# Altium schematic sheet Ext_connectors.SchDoc: SPEC-A7
size 420 x 297 mm; Author: G.Kasprowicz; CompanyName: WUT ISE; DrawnBy: G.Kasprowicz; Organization: WUT ISE; Address1: PW ISE; Address2: Nowowiejska 15/19 00-665 Warsaw; Address3: gkasprow@gmail.com; Revision: 2; SheetNumber: 14; SheetTotal: 18; ModifiedBy: -; CheckedDate: -; Title2: Mezzanine connectors; DivGrp: WUT ISE; Designer: G.Kasprowicz; ModifiedDate: -; ProjectName: Sensor Box
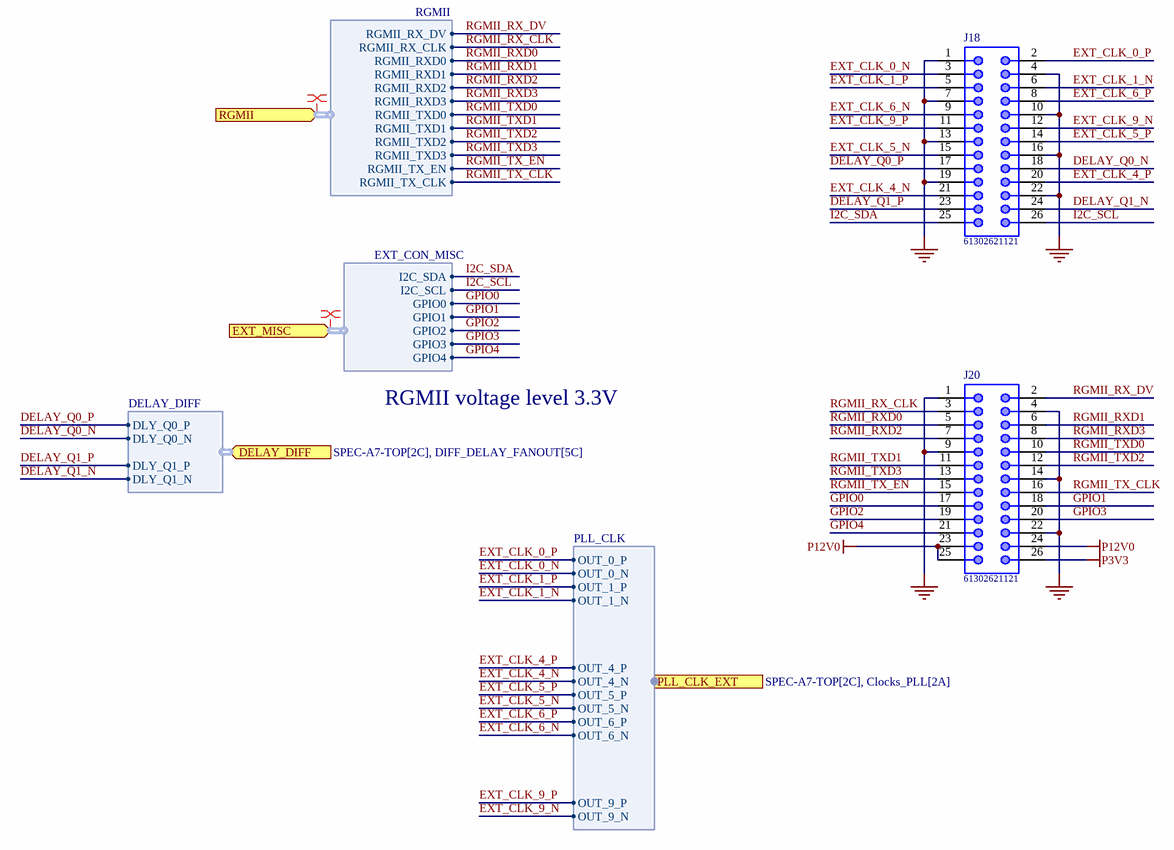
[diagram p0: Ext_connectors.SchDoc]

## Parts
J18  61302621121  [61302621121]
J20  61302621121  [61302621121]

## Ports
DELAY_DIFF (in, harness DELAY_DIFF, see SPEC-A7-TOP[2C], DIFF_DELAY_FANOUT[5C]), EXT_MISC (in, harness EXT_CON_MISC, see SPEC-A7-TOP[2C], FPGA_34[4B]), PLL_CLK_EXT (harness PLL_CLK, see SPEC-A7-TOP[2C], Clocks_PLL[2A]), RGMII (in, harness RGMII, see SPEC-A7-TOP[2C], FPGA_34[4D])

## Harnesses
RGMII: RGMII_RX_DV, RGMII_RX_CLK, RGMII_RXD0, RGMII_RXD1, RGMII_RXD2, RGMII_RXD3, RGMII_TXD0, RGMII_TXD1, RGMII_TXD2, RGMII_TXD3, RGMII_TX_EN, RGMII_TX_CLK
EXT_CON_MISC: I2C_SDA, I2C_SCL, GPIO0, GPIO1, GPIO2, GPIO3, GPIO4
PLL_CLK: OUT_0_P, OUT_0_N, OUT_1_P, OUT_1_N, OUT_4_P, OUT_4_N, OUT_5_P, OUT_5_N, OUT_6_P, OUT_6_N, OUT_9_P, OUT_9_N
DELAY_DIFF: DLY_Q0_P, DLY_Q0_N, DLY_Q1_P, DLY_Q1_N

## Nets
GND: J18.1 J18.4 J18.7 J18.10 J18.13 J18.16 J18.19 J18.22 J20.1 J20.4 J20.9 J20.14 J20.22
P3V3: J20.26
P12V0: J20.23 J20.24 J20.25
DELAY_Q0_N: J18.18 ; port DELAY_DIFF.DLY_Q0_N
DELAY_Q0_P: J18.17 ; port DELAY_DIFF.DLY_Q0_P
DELAY_Q1_N: J18.24 ; port DELAY_DIFF.DLY_Q1_N
DELAY_Q1_P: J18.23 ; port DELAY_DIFF.DLY_Q1_P
EXT_CLK_0_N: J18.3 ; port PLL_CLK_EXT.OUT_0_N
EXT_CLK_0_P: J18.2 ; port PLL_CLK_EXT.OUT_0_P
EXT_CLK_1_N: J18.6 ; port PLL_CLK_EXT.OUT_1_N
EXT_CLK_1_P: J18.5 ; port PLL_CLK_EXT.OUT_1_P
EXT_CLK_4_N: J18.21 ; port PLL_CLK_EXT.OUT_4_N
EXT_CLK_4_P: J18.20 ; port PLL_CLK_EXT.OUT_4_P
EXT_CLK_5_N: J18.15 ; port PLL_CLK_EXT.OUT_5_N
EXT_CLK_5_P: J18.14 ; port PLL_CLK_EXT.OUT_5_P
EXT_CLK_6_N: J18.9 ; port PLL_CLK_EXT.OUT_6_N
EXT_CLK_6_P: J18.8 ; port PLL_CLK_EXT.OUT_6_P
EXT_CLK_9_N: J18.12 ; port PLL_CLK_EXT.OUT_9_N
EXT_CLK_9_P: J18.11 ; port PLL_CLK_EXT.OUT_9_P
GPIO0: J20.17 ; port EXT_MISC.GPIO0
GPIO1: J20.18 ; port EXT_MISC.GPIO1
GPIO2: J20.19 ; port EXT_MISC.GPIO2
GPIO3: J20.20 ; port EXT_MISC.GPIO3
GPIO4: J20.21 ; port EXT_MISC.GPIO4
I2C_SCL: J18.26 ; port EXT_MISC.I2C_SCL
I2C_SDA: J18.25 ; port EXT_MISC.I2C_SDA
RGMII_RX_CLK: J20.3 ; port RGMII.RGMII_RX_CLK
RGMII_RX_DV: J20.2 ; port RGMII.RGMII_RX_DV
RGMII_RXD0: J20.5 ; port RGMII.RGMII_RXD0
RGMII_RXD1: J20.6 ; port RGMII.RGMII_RXD1
RGMII_RXD2: J20.7 ; port RGMII.RGMII_RXD2
RGMII_RXD3: J20.8 ; port RGMII.RGMII_RXD3
RGMII_TX_CLK: J20.16 ; port RGMII.RGMII_TX_CLK
RGMII_TX_EN: J20.15 ; port RGMII.RGMII_TX_EN
RGMII_TXD0: J20.10 ; port RGMII.RGMII_TXD0
RGMII_TXD1: J20.11 ; port RGMII.RGMII_TXD1
RGMII_TXD2: J20.12 ; port RGMII.RGMII_TXD2
RGMII_TXD3: J20.13 ; port RGMII.RGMII_TXD3

## Layout directives
net class RGMII: (no net found under the mark)
net class MISC: (no net found under the mark)

## Notes on the sheet
- RGMII voltage level 3.3V
- Project/Equipment
- Document
- Designer
- Drawn by
- Check.by
- Copyright WUT ISE 2024.
  This documentation describes Open Hardware and is licensed under the CERN OHL v.2. You may redistribute and modify this documentation under the terms of the CERN OHL v.2. (http://ohwr.org/CERNOHL). This documentation is distributed WITHOUT ANY EXPRESS OR IMPLIED WARRANTY, INCLUDING OF MERCHANTABILITY, SATISFACTORY QUALITY AND FITNESS FOR A PARTICULAR PURPOSE. Please see the CERN OHL v.2 for applicable conditions.
- Contact
- File
- Last Mod.
- Print Date
- Sheet
- Size
- A3
- of
- Rev

## Library data of the parts
J18 J20 = 61302621121: WR-PHD Pin Header, THT, pitch 2.54mm, Dual Row, Vertical, 26pin; Pin Number: 26; Gender: Male; Rated Current: 3A; Working Voltage: 250VAC; Withstanding Voltage: 500VAC; Contact Resistance: 20mOhm; ComponentLink1Description: Manufacturer; ComponentLink1URL: http://www.we-online.de; ComponentLink2Description: Datasheet; ComponentLink2URL: https://katalog.we-online.de/em/datasheet/6130xx21121.pdf; Part Number: 61302621121; Published Date: June 2019; Publisher: Wurth Elektronik; Pitch: 2.54mm; Operating Temperature: -40 to +105degC; Mounting Technology: THT; Packaging: Bag; Row Number: Dual; Orientation: Vertical